# EAGLE design tricorder-featherwing-mk-1.1 (EAGLE 7.5.0)
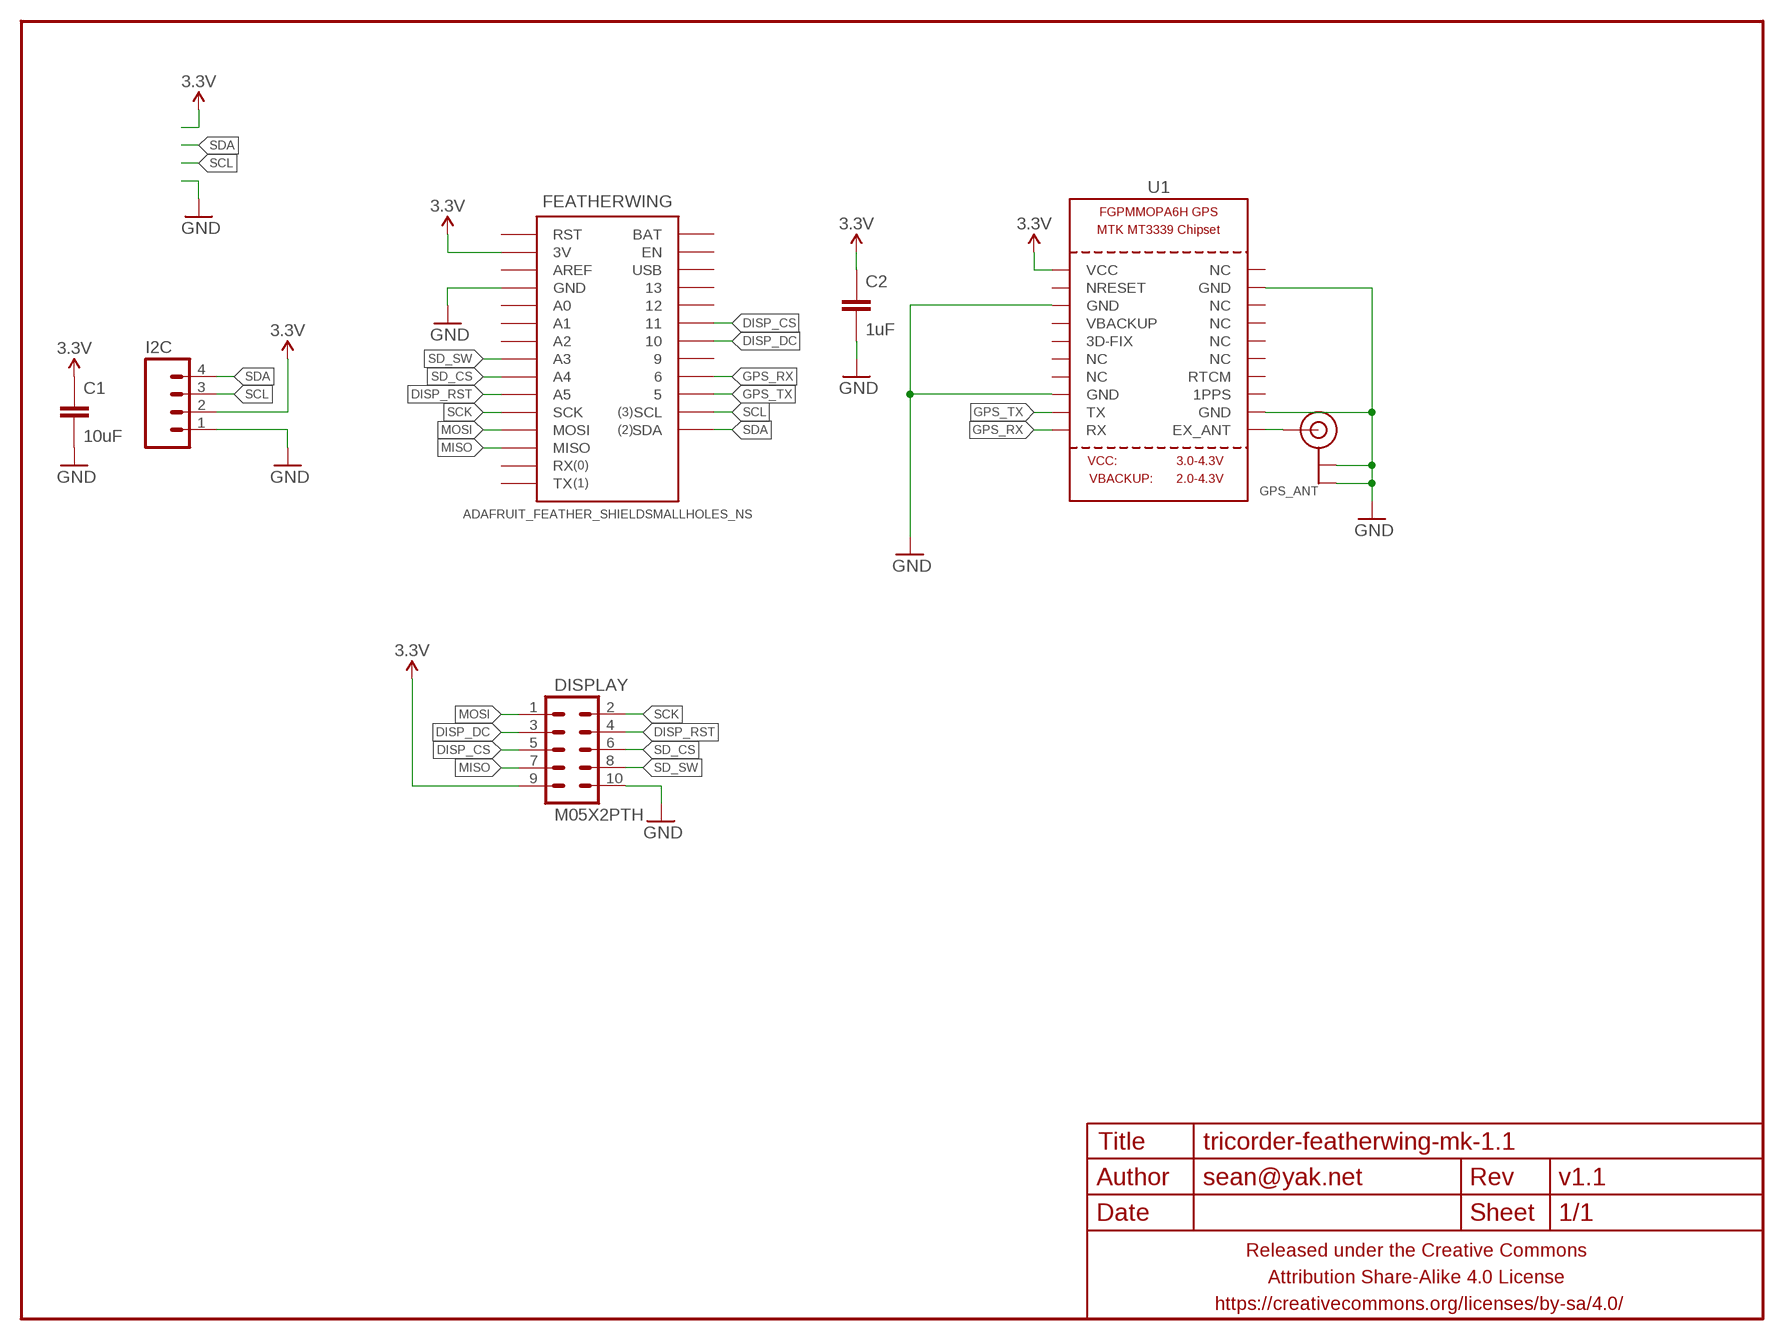
[diagram p0: schematic, sheet 1]

## Parts
C1  10uF  CAPACITOR-CERAMICC1210  [C1210]
C2  1uF  CAPACITOR-CERAMICC0603  [C0603]
DISPLAY  M05X2PTH  [AVR_ICSP]
FEATHERWING  ADAFRUIT_FEATHER_SHIELDSMALLHOLES_NS  [ADAFRUIT_FEATHER_SMALLHOLES_NS]
FRAME1  FRAME-LETTERNO_PACKAGE  [DUMMY]
GPS_ANT  ANTENNA_U.FL  [U.FL]
I2C  M04PTH  [1X04-PTH-VERT]
U1  GPS_FGPMMOPA6H  [FGPMMOPA6H]

## Nets
3.3V: C1.1 C2.1 DISPLAY.9 FEATHERWING.3V I2C.2 U1.P$1(VCC)
DISP_CS: DISPLAY.5 FEATHERWING.11
DISP_DC: DISPLAY.3 FEATHERWING.10
DISP_RST: DISPLAY.4 FEATHERWING.A5
GND: C1.2 C2.2 DISPLAY.10 FEATHERWING.GND@0(GND) FEATHERWING.GND@1(GND) GPS_ANT.1(GND) GPS_ANT.2(GND) I2C.1 U1.P$3(GND) U1.P$8(GND) U1.P$12(GND) U1.P$19(GND)
GPS_RX: FEATHERWING.6 U1.P$10(RX)
GPS_TX: FEATHERWING.5 U1.P$9(TX)
MISO: DISPLAY.7 FEATHERWING.MISO
MOSI: DISPLAY.1 FEATHERWING.MOSI
N$1: GPS_ANT.3(SIGNAL) U1.P$11(EX_ANT)
SCK: DISPLAY.2 FEATHERWING.SCK
SCL: FEATHERWING.SCL I2C.3
SD_CS: DISPLAY.6 FEATHERWING.A4
SD_SW: DISPLAY.8 FEATHERWING.A3
SDA: FEATHERWING.SDA I2C.4
Unconnected: FEATHERWING.9 FEATHERWING.12 FEATHERWING.13 FEATHERWING.A0 FEATHERWING.A1 FEATHERWING.A2 FEATHERWING.AREF FEATHERWING.BAT FEATHERWING.EN FEATHERWING.RST FEATHERWING.RX FEATHERWING.TX FEATHERWING.USB U1.P$2(NRESET) U1.P$4(VBACKUP) U1.P$5(3D-FIX) U1.P$6(NC) U1.P$7(NC) U1.P$13(1PPS) U1.P$14(RTCM) U1.P$15(NC) U1.P$16(NC) U1.P$17(NC) U1.P$18(NC) U1.P$20(NC)

## Library data of the parts
C1 C2 = a_parts:CAPACITOR-CERAMIC: CAPACITOR, European symbol
DISPLAY = a_parts:M05X2: Header 5x2 Standard 10-pin dual row 0.1" header. Commonly used with AVR-ISP. Use with Spark Fun Electronics SKU: PRT-00778
FEATHERWING = a_parts:ADAFRUIT_FEATHER_SHIELD
FRAME1 = a_parts:FRAME-LETTER: Schematic Frame Standard 8.5x11 US Letter frame; DESIGNER: sean@yak.net; VERSION: v1.1
GPS_ANT = a_parts:ANTENNA_U.FL: U.FL Antenna Connector
I2C = a_parts:M04: Header 4 Standard 4-pin 0.1" header. Use with straight break away headers (SKU : PRT-00116), right angle break away headers (PRT-00553), swiss pins (PRT-00743), machine pins (PRT-00117), and female headers (PRT-00115). Molex polarized connector foot print use with SKU : PRT-08231 with associated crimp pins and housings. 1MM SMD Version SKU: PRT-10208
U1 = a_parts:GPS_FGPMMOPA6H: GPS Module - MTK MT3339 Chipset, -165dBm sensitivity, 22 channels, 10Hz, auto-select external antenna options

## Board
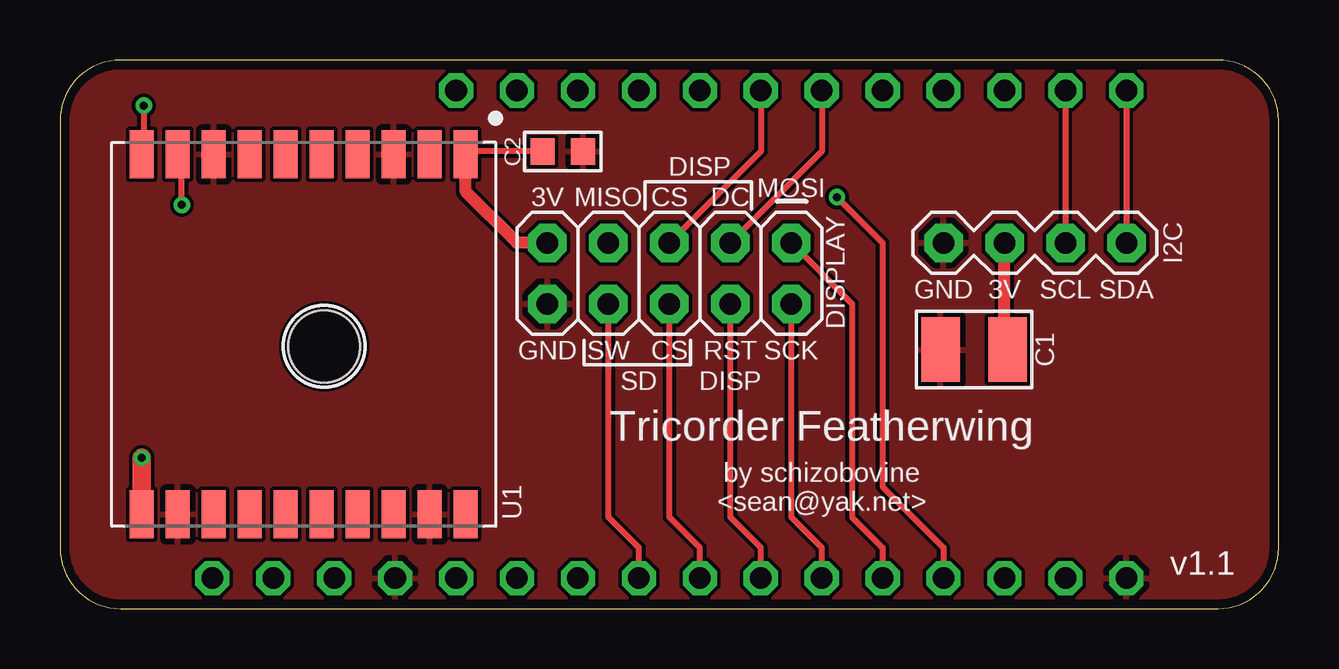
[diagram p1: board, top side]
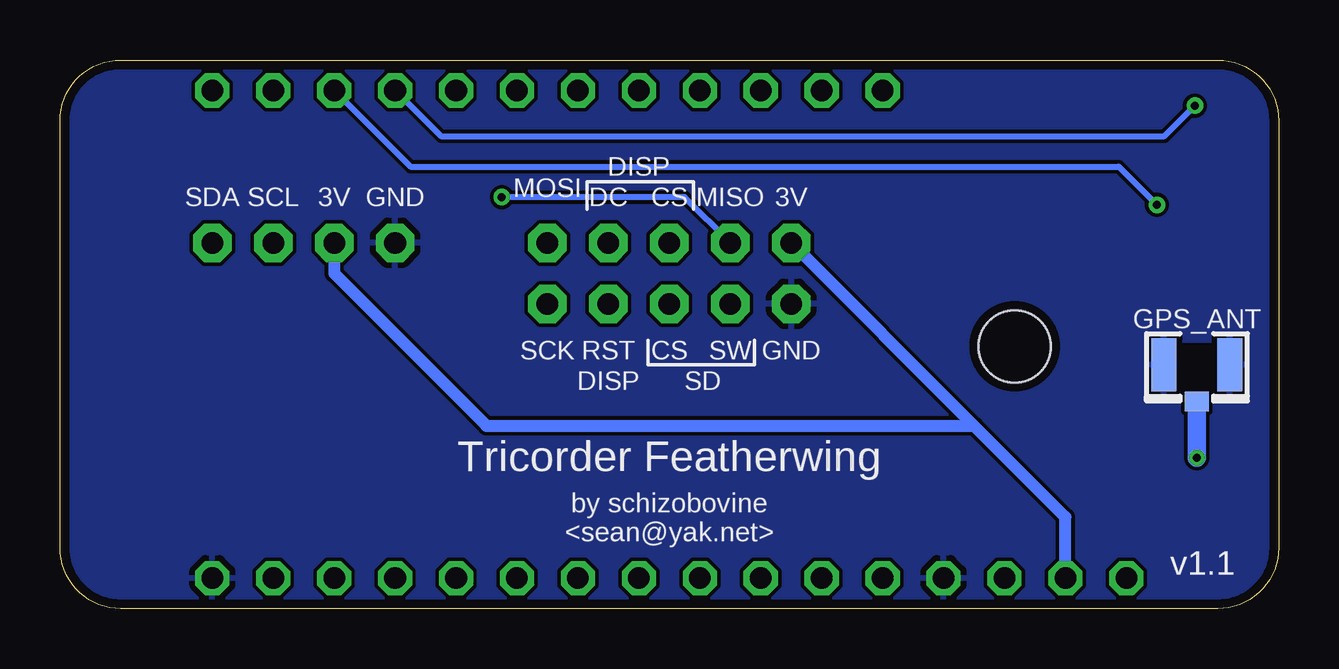
[diagram p2: board, bottom side, seen from below]

Size 50.8 x 22.86 mm. Coordinates in mm from the lower left corner, seen from the top.
Outline: 0,20.32 0,2.54 arc90 2.54,0 48.26,0 arc90 50.8,2.54 50.8,20.32 arc90 48.26,22.86 2.54,22.86 arc90 0,20.32
Copper layers (1*16): Top 0.0356mm / dielectric 1.5011mm / Bottom 0.0356mm
Design rules "LaenPCBOrder2": minimum track width 6mil, minimum drill 13mil, track to track 6mil, track to pad 6mil, pad to pad 6mil, via to via 6mil, smd to smd 6mil, copper to edge 15mil, drill to drill 6mil, minimum pad ring 7mil, minimum via ring 7mil, stop-mask expansion 3mil, vias tented up to drill 20mil, thermal gap 10mil

### Footprints (pad centres in the part's own frame; a part is rotated, then mirrored left to right if it is on the bottom)
C1210 = smd 1.6 x 2.7: 1 -1.4,0; 2 1.4,0
C0603 = smd 1 x 1.1: 1 -0.85,0; 2 0.85,0
AVR_ICSP = drill 0.9 pad 1.6 octagon: 1 -5.08,-1.27; 2 -5.08,1.27; 3 -2.54,-1.27; 4 -2.54,1.27; 5 0,-1.27; 6 0,1.27; 7 2.54,-1.27; 8 2.54,1.27; 9 5.08,-1.27; 10 5.08,1.27
ADAFRUIT_FEATHER_SMALLHOLES_NS = drill 0.9 pad 1.422 octagon: 3V -16.51,-10.16; 5 13.97,10.16; 6 11.43,10.16; 9 8.89,10.16; 10 6.35,10.16; 11 3.81,10.16; 12 1.27,10.16; 13 -1.27,10.16; A0 -8.89,-10.16; A1 -6.35,-10.16; A2 -3.81,-10.16; A3 -1.27,-10.16; A4 1.27,-10.16; A5 3.81,-10.16; AREF -13.97,-10.16; BAT -8.89,10.16; EN -6.35,10.16; GND@0 -11.43,-10.16; GND@1 19.05,-10.16; MISO 11.43,-10.16; MOSI 8.89,-10.16; RST -19.05,-10.16; RX 13.97,-10.16; SCK 6.35,-10.16; SCL 16.51,10.16; SDA 19.05,10.16; TX 16.51,-10.16; USB -3.81,10.16
U.FL = smd 2.2 x 1.05: 1 0,1.375; 2 0,-1.375 | smd 0.8 x 1: 3 1.525,0
1X04-PTH-VERT = drill 0.9 pad 1.6 octagon: 1 0,0; 2 2.54,0; 3 5.08,0; 4 7.62,0
FGPMMOPA6H = smd 2 x 1: P$1 -7.5,6.75; P$2 -7.5,5.25; P$3 -7.5,3.75; P$4 -7.5,2.25; P$5 -7.5,0.75; P$6 -7.5,-0.75; P$7 -7.5,-2.25; P$8 -7.5,-3.75; P$9 -7.5,-5.25; P$10 -7.5,-6.75; P$11 7.5,-6.75; P$12 7.5,-5.25; P$13 7.5,-3.75; P$14 7.5,-2.25; P$15 7.5,-0.75; P$16 7.5,0.75; P$17 7.5,2.25; P$18 7.5,3.75; P$19 7.5,5.25; P$20 7.5,6.75 | hole 3: 0.5,0.85

### Placement (x,y rotation side)
C1  38.1,10.79 180 top
C2  20.95,19.05 0 top
DISPLAY  25.4,13.97 180 top
FEATHERWING  25.4,11.43 0 top
FRAME1  0,0 0 top
GPS_ANT  3.41,10.16 270 bottom
I2C  36.83,15.24 0 top
U1  10.16,11.43 270 top

### Tracks (layer width: path | path; a pad name or v marks a point on that pad's centre or on a via)
3.3V
  Top 0.254: C2.1 17.03,19.05 U1.P$1
  Top 0.508: DISPLAY.9 19.05,15.24 16.91,17.38 U1.P$1 | C1.1 39.37,10.93 I2C.2
  Bottom 0.508: FEATHERWING.3V 8.89,3.81 12.7,7.62 | 12.7,7.62 DISPLAY.9 | I2C.2 39.37,13.97 33.02,7.62 12.7,7.62
DISP_CS
  Top 0.254: FEATHERWING.11 29.21,19.05 DISPLAY.5
DISP_DC
  Top 0.254: FEATHERWING.10 31.75,19.05 DISPLAY.3
DISP_RST
  Top 0.254: FEATHERWING.A5 29.21,2.54 27.94,3.81 DISPLAY.4
GND
  pour Bottom: 0,20.32 0,2.54 arc90 2.54,0 48.26,0 arc90 50.8,2.54 50.8,20.32 arc90 48.26,22.86 2.54,22.86 arc90
  pour Top: 0,20.32 0,2.54 arc90 2.54,0 48.26,0 arc90 50.8,2.54 50.8,20.32 arc90 48.26,22.86 2.54,22.86 arc90
GPS_RX  (via drill 0.33)
  Top 0.254: v3.49,20.95 3.49,19.01 U1.P$10
  Bottom 0.254: FEATHERWING.6 34.92,19.68 4.76,19.68 v3.49,20.95
GPS_TX  (via drill 0.33)
  Top 0.254: v5.08,16.83 5.08,18.76 U1.P$9
  Bottom 0.254: FEATHERWING.5 36.2,18.41 6.67,18.41 v5.08,16.83
MISO  (via drill 0.33)
  Top 0.254: v32.38,17.14 34.29,15.24 34.29,5.08 36.83,2.54 FEATHERWING.MISO
  Bottom 0.254: DISPLAY.7 24.77,17.14 v32.38,17.14
MOSI
  Top 0.254: DISPLAY.1 33.02,12.7 33.02,3.81 34.29,2.54 FEATHERWING.MOSI
N$1  (via drill 0.33)
  Top 0.762: U1.P$11 v3.41,6.29
  Bottom 0.762: v3.41,6.29 GPS_ANT.3
SCK
  Top 0.254: FEATHERWING.SCK 31.75,2.54 30.48,3.81 DISPLAY.2
SCL
  Top 0.254: FEATHERWING.SCL I2C.3
SD_CS
  Top 0.254: FEATHERWING.A4 26.67,2.54 25.4,3.81 DISPLAY.6
SD_SW
  Top 0.254: FEATHERWING.A3 24.13,2.54 22.86,3.81 DISPLAY.8
SDA
  Top 0.254: FEATHERWING.SDA I2C.4

### Text on the board
tPlace: DISP | 3V | MISO | CS | DC | MOSI | GND | 3V | SCL | SDA | GND | SW | CS | RST | SCK | SD | DISP | Tricorder Featherwing | by schizobovine / <sean@yak.net>
bPlace: DISP | 3V | MISO | CS | DC | MOSI | GND | 3V | SCL | SDA | GND | SW | CS | RST | SCK | SD | DISP | Tricorder Featherwing | by schizobovine / <sean@yak.net>